# Altium schematic sheet Sheet1.SchDoc
size A; SheetNumber: 1; SheetTotal: 1
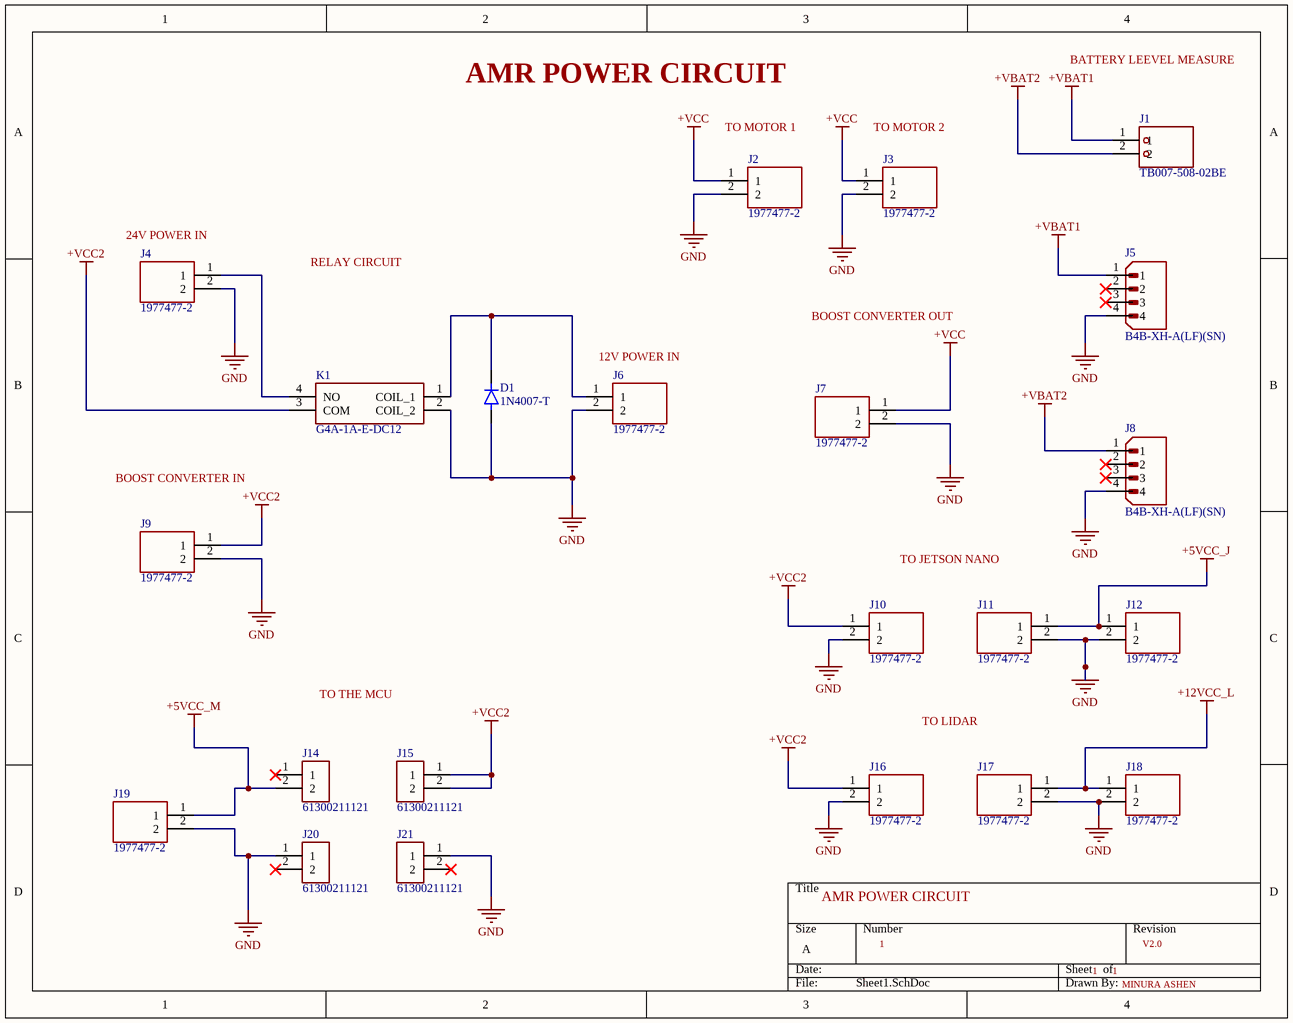
[diagram p0: Sheet1.SchDoc]

## Parts
D1  1N4007-T  [DIOAD780W78L463D236]
J1  TB007-508-02BE  [CUI_TB007-508-02BE]
J2  1977477-2  [TE_1977477-2]
J3  1977477-2  [TE_1977477-2]
J4  1977477-2  [TE_1977477-2]
J5  B4B-XH-A(LF)(SN)  [JST_B4B-XH-A(LF)(SN)]
J6  1977477-2  [TE_1977477-2]
J7  1977477-2  [TE_1977477-2]
J8  B4B-XH-A(LF)(SN)  [JST_B4B-XH-A(LF)(SN)]
J9  1977477-2  [TE_1977477-2]
J10  1977477-2  [TE_1977477-2]
J11  1977477-2  [TE_1977477-2]
J12  1977477-2  [TE_1977477-2]
J14  61300211121  [HDRV2W110P0X254_1X2_508X254X854P]
J15  61300211121  [HDRV2W110P0X254_1X2_508X254X854P]
J16  1977477-2  [TE_1977477-2]
J17  1977477-2  [TE_1977477-2]
J18  1977477-2  [TE_1977477-2]
J19  1977477-2  [TE_1977477-2]
J20  61300211121  [HDRV2W110P0X254_1X2_508X254X854P]
J21  61300211121  [HDRV2W110P0X254_1X2_508X254X854P]
K1  G4A-1A-E-DC12  [G4A1AEDC12]

## Nets
+5VCC_J: J11.1 J12.1
+5VCC_M: J14.2 J19.1
+12VCC_L: J17.1 J18.1
+VBAT1: J1.1 J5.1
+VBAT2: J1.2 J8.1
+VCC: J2.1 J3.1 J7.1
+VCC2: J9.1 J10.1 J15.1 J15.2 J16.1 K1.3(COM)
GND: D1.A J2.2 J3.2 J4.2 J5.4 J6.2 J7.2 J8.4 J9.2 J10.2 J11.2 J12.2 J16.2 J17.2 J18.2 J19.2 J20.1 J21.1 K1.2(COIL_2)
NetD1_K: D1.K J6.1 K1.1(COIL_1)
NetJ4_1: J4.1 K1.4(NO)

Not connected (* = marked no-connect by the designer): J5 2* 3*; J8 2* 3*; J14 1*; J20 2*; J21 2*

## Notes on the sheet
- AMR POWER CIRCUIT
- BATTERY LEEVEL MEASURE
- (near J2) TO MOTOR 1
- (near J3) TO MOTOR 2
- (near J4) 24V POWER IN
- RELAY CIRCUIT
- (near J6) 12V POWER IN
- BOOST CONVERTER OUT
- BOOST CONVERTER IN
- TO JETSON NANO
- TO THE MCU
- TO LIDAR
- 1
- V2.0
- MINURA ASHEN

## Library data of the parts
D1 = 1N4007-T: Diode Standard 1000 V 1A Through Hole DO-41; MF: Yangjie Technology; MP: 1N4007; SnapEDA_Link: https://www.snapeda.com/parts/1N4007/Yangjie+Electronic+Technology/view-part/?ref=snap; Package: DO-41 NTE Electronics; Value: *; Check_prices: https://www.snapeda.com/parts/1N4007/Yangjie+Electronic+Technology/view-part/?ref=eda
J1 = TB007-508-02BE: 2~24 Poles, Screw Type, Horizontal, 5.08 Pitch, 24~12 (AWG), Terminal Block Connector; MF: Same Sky; SnapEDA_Link: https://www.snapeda.com/parts/TB007-508-02BE/Same+Sky/view-part/?ref=snap; Package: None; Value: *; MP: TB007-508-02BE; Check_prices: https://www.snapeda.com/parts/TB007-508-02BE/Same+Sky/view-part/?ref=eda
J2-J4 J6 J7 J9-J12 J16-J19 = 1977477-2: Buchanan, Module Dual Barrier, .325 CL, 2 Pos. | TE Connectivity 1977477-2; SnapEDA_Link: https://www.snapeda.com/parts/1977477-2/TE+Connectivity+AMP+Connectors/view-part/?ref=snap; Package: None; Value: *; MF: TE Connectivity; MP: 1977477-2; Check_prices: https://www.snapeda.com/parts/1977477-2/TE+Connectivity+AMP+Connectors/view-part/?ref=eda
J5 J8 = B4B-XH-A(LF)(SN): Connector Header Through Hole 4 position 0.098 (2.50mm); MF: JST Sales; SnapEDA_Link: https://www.snapeda.com/parts/B4B-XH-A(LF)(SN)/JST+Sales+America+Inc./view-part/?ref=snap; Package: None; Value: *; MP: B4B-XH-A(LF)(SN); Check_prices: https://www.snapeda.com/parts/B4B-XH-A(LF)(SN)/JST+Sales+America+Inc./view-part/?ref=eda
J14 J15 J20 J21 = 61300211121: WURTH ELEKTRONIK - 61300211121 - HEADER, 2.54MM, PIN, THT, VERTICAL, 2WAY; Geometry.Height: 8.54mm; Mouser Part Number: 710-61300211121; Mouser Price/Stock: https://www.mouser.co.uk/ProductDetail/Wurth-Elektronik/61300211121?qs=t4813l51qx%252B1A5GYDQxPlw%3D%3D; Manufacturer_Name: Wurth Elektronik; Manufacturer_Part_Number: 61300211121; Datasheet Link: https://componentsearchengine.com/Datasheets/2/61300211121.pdf
K1 = G4A-1A-E-DC12: General Purpose Relays SPST-NO 12VDC PCB & QC; Manufacturer_Name: Omron Electronics; Geometry.Height: 33.5mm; Mouser Part Number: 653-G4A-1AE-DC12; Mouser Price/Stock: https://www.mouser.co.uk/ProductDetail/Omron-Electronics/G4A-1A-E-DC12?qs=sQVrL4YZhsSR4KC%252B99SM1w%3D%3D; Manufacturer_Part_Number: G4A-1A-E-DC12; Datasheet Link: https://omronfs.omron.com/en_US/ecb/products/pdf/en-g4a.pdf